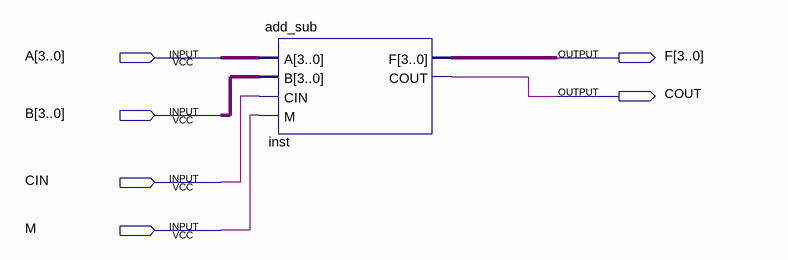
[diagram p0: schematic sheet]
// Quartus schematic B1.bdf as structural Verilog: 1 symbols, 6 pins
module B1 (
  input  [3:0] A,
  input  [3:0] B,
  input  CIN,
  input  M,
  output [3:0] F,
  output COUT
);

  add_sub inst (.A(A), .B(B), .CIN(CIN), .M(M), .F(F), .COUT(COUT));
endmodule
